# EAGLE design DrinkDispenser (EAGLE 7.5.0)
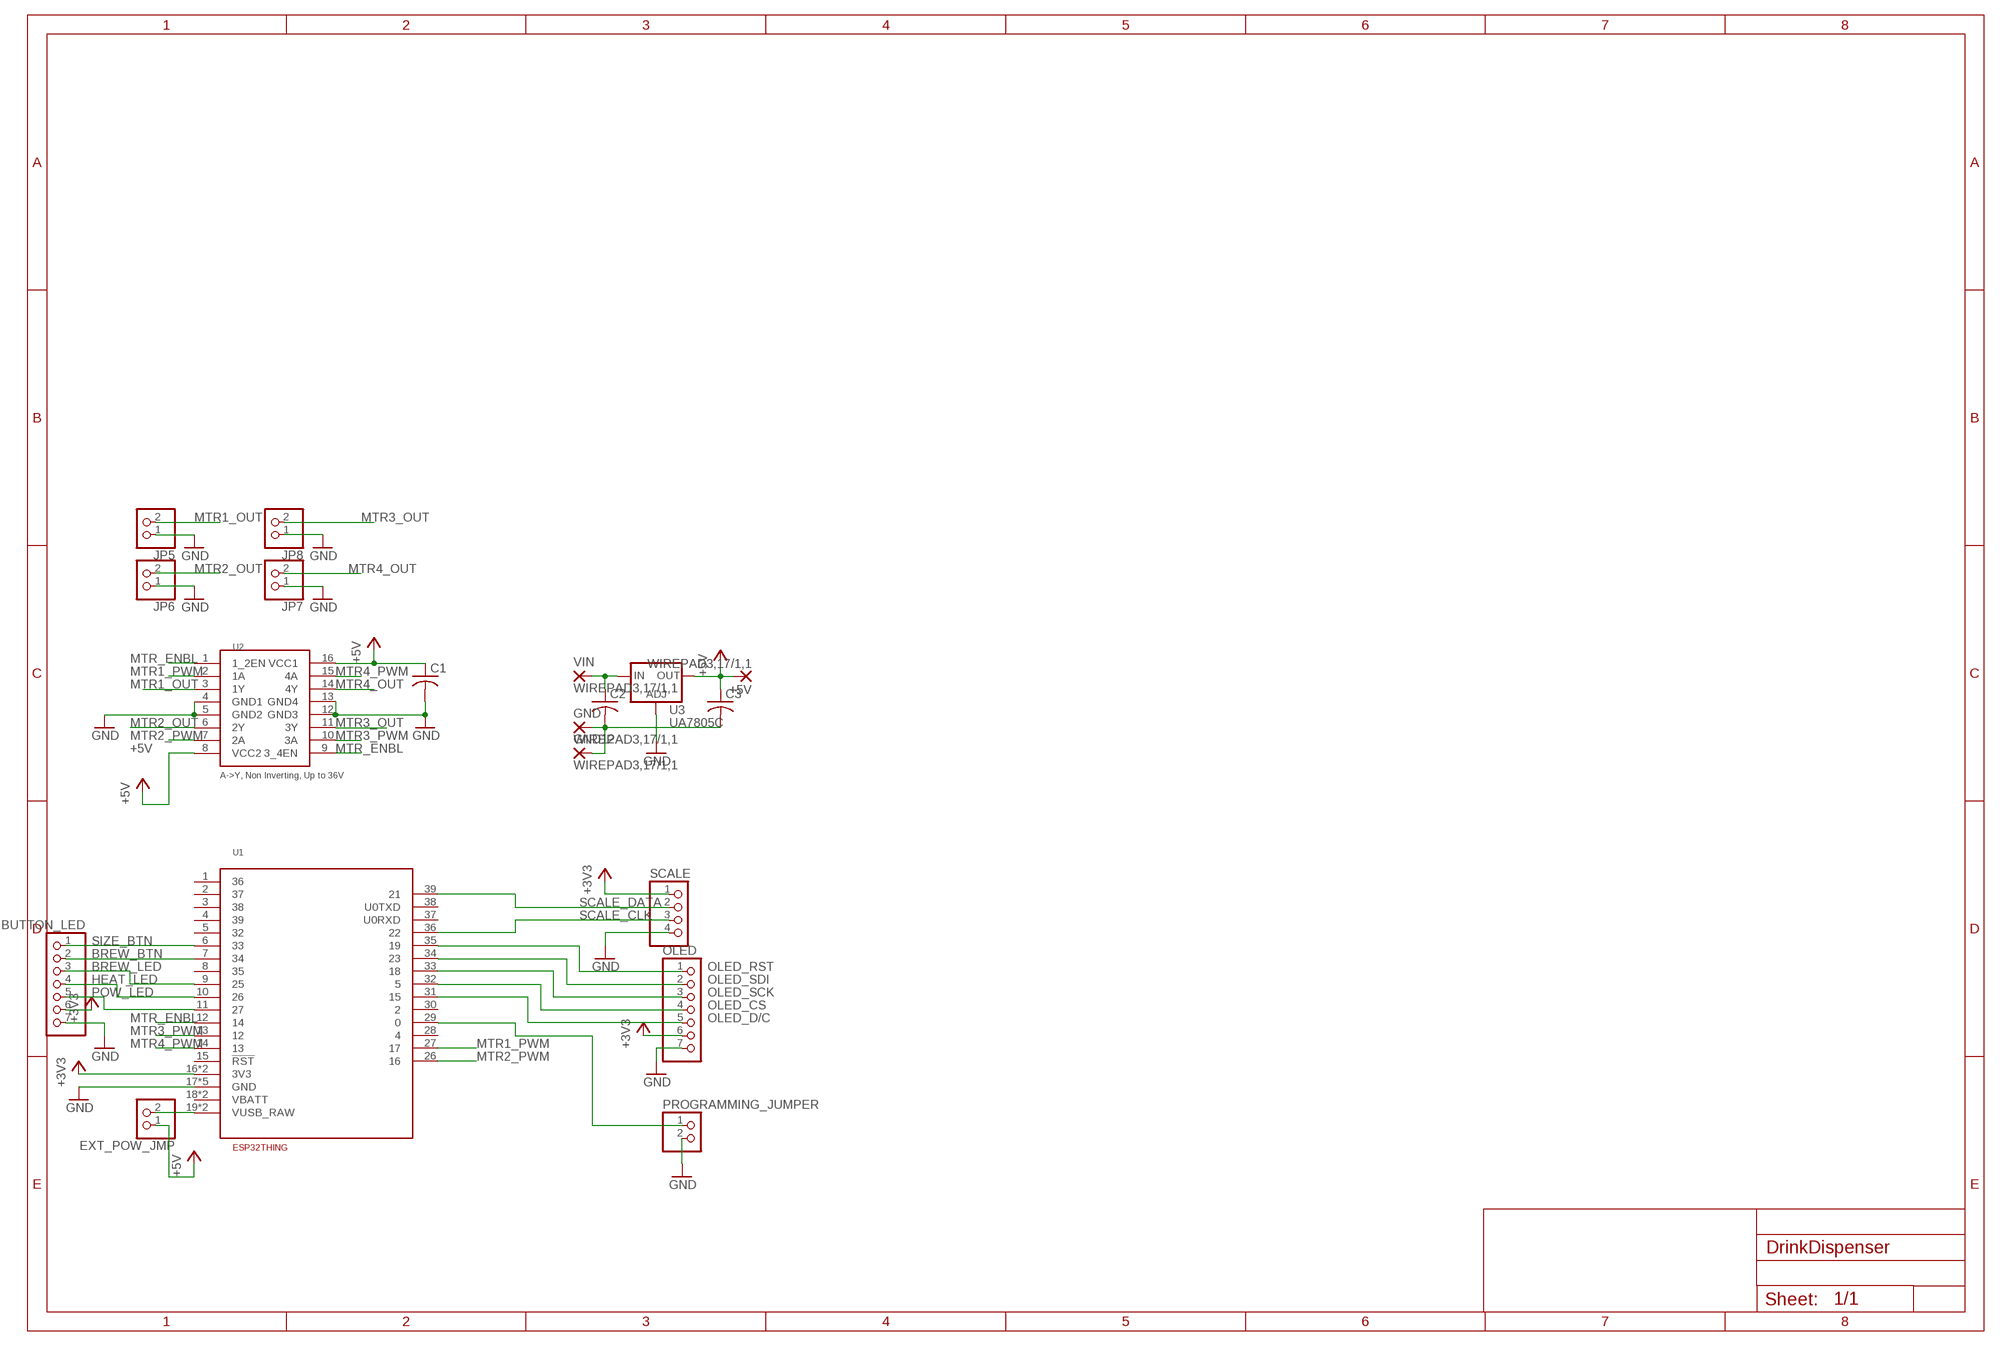
[diagram p0: schematic, sheet 1]

## Parts
+5V  WIREPAD3,17/1,1  [3,17/1,1]
BUTTON_LED  PINHD-1X7  [1X07]
C1  C-USC0805  [C0805]
C2  C-USC0805  [C0805]
C3  C-USC0805  [C0805]
EXT_POW_JMP  PINHD-1X2  [1X02]
GND  WIREPAD3,17/1,1  [3,17/1,1]
GND12  WIREPAD3,17/1,1  [3,17/1,1]
JP5  PINHD-1X2  [1X02]
JP6  PINHD-1X2  [1X02]
JP7  PINHD-1X2  [1X02]
JP8  PINHD-1X2  [1X02]
OLED  PINHD-1X7  [1X07]
PROGRAMMING_JUMPER  PINHD-1X2  [1X02]
SCALE  PINHD-1X4  [1X04]
U1  ESP32THING  [ESP32THING]
U2  L293DDIP16  [DIP16_7.62MM]
U3  UA7805C  [TO-263]
VIN  WIREPAD3,17/1,1  [3,17/1,1]

## Nets
+3V3: BUTTON_LED.6 OLED.6 SCALE.1 U1.16(3V3) U1.25(3V3)
+5V: +5V.1(P) C1.1 C3.1 EXT_POW_JMP.1 U2.8(VCC2) U2.16(VCC1) U3.3(OUT)
BREW_BTN: BUTTON_LED.2 U1.7
BREW_LED: BUTTON_LED.3 U1.9
GND: BUTTON_LED.7 C1.2 C2.2 C3.2 GND12.1(P) GND.1(P) JP5.1 JP6.1 JP7.1 JP8.1 OLED.7 PROGRAMMING_JUMPER.2 SCALE.4 U1.17(GND) U1.20(GND) U1.21(GND) U1.24(GND) U1.40(GND) U2.4(GND1) U2.5(GND2) U2.12(GND3) U2.13(GND4) U3.2(ADJ) U3.4(ADJ)
HEAT_LED: BUTTON_LED.4 U1.10
MTR1_OUT: JP5.2 U2.3(1Y)
MTR1_PWM: U1.27 U2.2(1A)
MTR2_OUT: JP6.2 U2.6(2Y)
MTR2_PWM: U1.26 U2.7(2A)
MTR3_OUT: JP8.2 U2.11(3Y)
MTR3_PWM: U1.13 U2.10(3A)
MTR4_OUT: JP7.2 U2.14(4Y)
MTR4_PWM: U1.14 U2.15(4A)
MTR_ENBL: U1.12 U2.1(1_2EN) U2.9(3_4EN)
N$1: C2.1 U3.1(IN) VIN.1(P)
N$2: EXT_POW_JMP.2 U1.19(VUSB_RAW) U1.23(VUSB_RAW)
N$3: PROGRAMMING_JUMPER.1 U1.29
OLED_CS: OLED.4 U1.32
OLED_D/C: OLED.5 U1.31
OLED_RST: OLED.1 U1.35
OLED_SCK: OLED.3 U1.33
OLED_SDI: OLED.2 U1.34
POW_LED: BUTTON_LED.5 U1.11
SCALE_CLK: SCALE.3 U1.36
SCALE_DATA: SCALE.2 U1.39
SIZE_BTN: BUTTON_LED.1 U1.6
Unconnected: U1.1 U1.2 U1.3 U1.4 U1.5 U1.8 U1.15(!RST) U1.18(VBATT) U1.22(VBATT) U1.28 U1.30 U1.37(U0RXD) U1.38(U0TXD)

## Library data of the parts
+5V GND GND12 VIN = wirepad:WIREPAD: Wire PAD connect wire on PCB
BUTTON_LED OLED = pinhead:PINHD-1X7: PIN HEADER
C1-C3 = DR:C-US: CAPACITOR, American symbol
EXT_POW_JMP JP5-JP8 PROGRAMMING_JUMPER = pinhead:PINHD-1X2: PIN HEADER
SCALE = pinhead:PINHD-1X4: PIN HEADER
U1 = DR:ESP32THING
U2 = DR:L293D: Motor Driver, Quadruple Half-H, 4.5-36V
U3 = DR:UA7805C

## Board
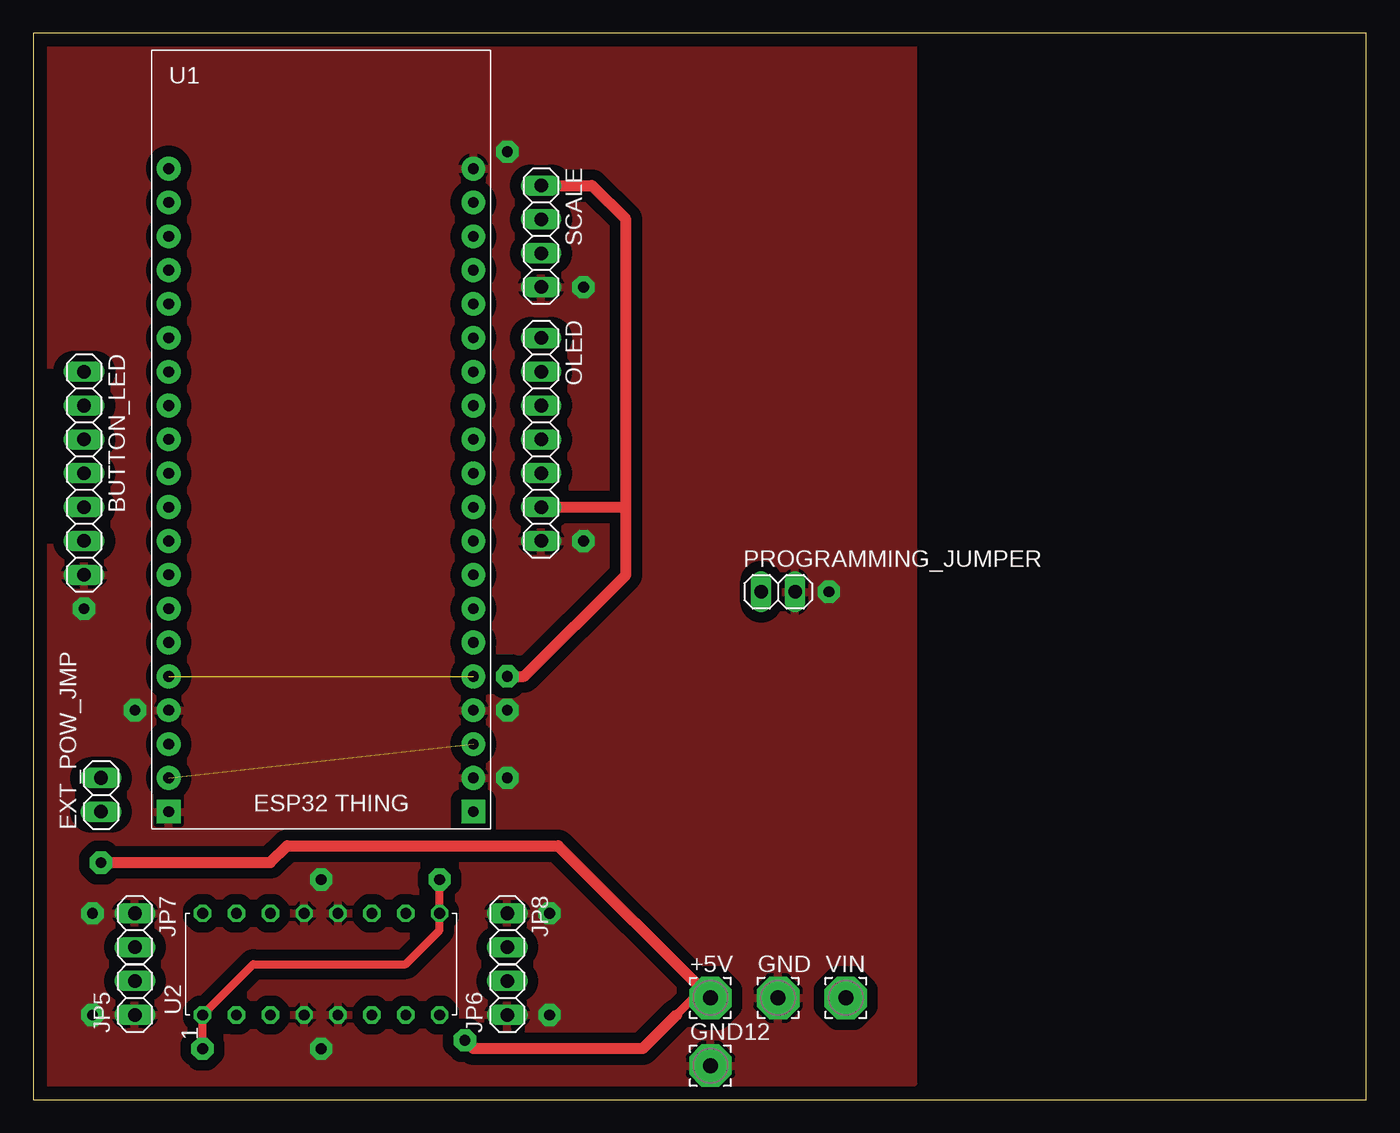
[diagram p1: board, top side]
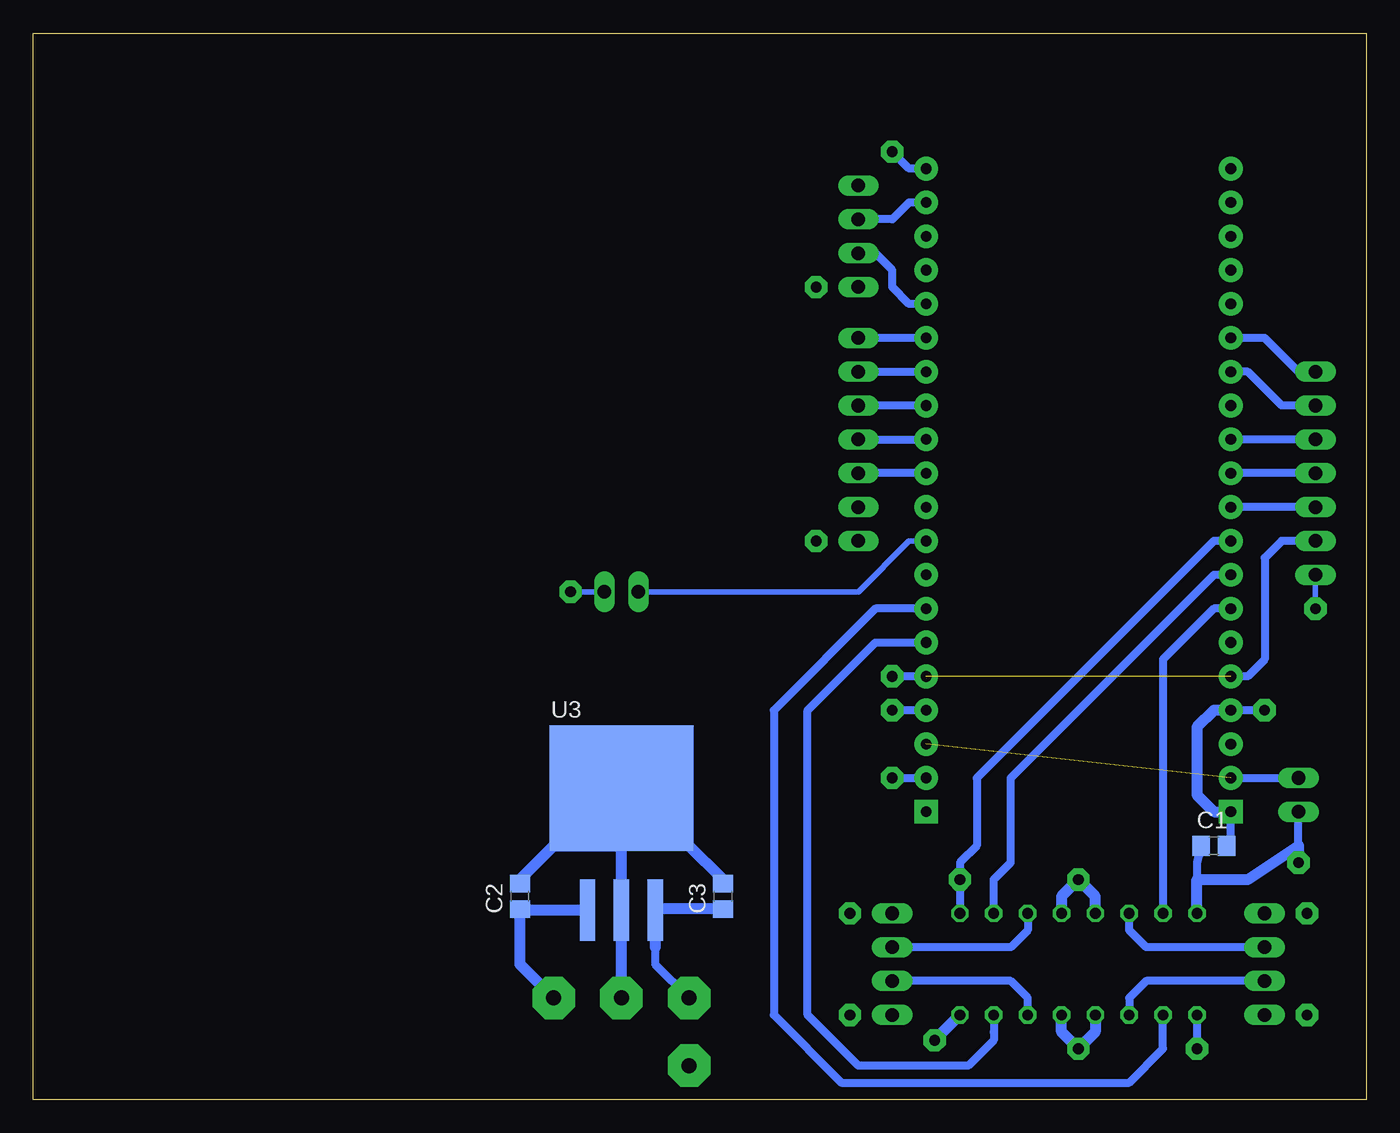
[diagram p2: board, bottom side, seen from below]

Size 100 x 80 mm. Coordinates in mm from the lower left corner, seen from the top.
Outline: 0,0 100,0 100,80 0,80 0,0
Copper layers (1*16): Top 0.035mm / dielectric 1.5mm / Bottom 0.035mm
Design rules "default": minimum track width 10mil, minimum drill 24mil, track to track 8mil, track to pad 8mil, pad to pad 8mil, via to via 8mil, smd to smd 8mil, copper to edge 40mil, drill to drill 8mil, minimum pad ring 10mil, minimum via ring 8mil, stop-mask expansion 4mil, vias tented up to drill 0mil, thermal gap 10mil

### Footprints (pad centres in the part's own frame; a part is rotated, then mirrored left to right if it is on the bottom)
3,17/1,1 = drill 1.118 pad 3.175 octagon: 1 0,0
1X07 = drill 1.016 long: 1 -7.62,0; 2 -5.08,0; 3 -2.54,0; 4 0,0; 5 2.54,0; 6 5.08,0; 7 7.62,0
C0805 = smd 1.3 x 1.5: 1 -0.95,0; 2 0.95,0
1X02 = drill 1.016 long: 1 -1.27,0; 2 1.27,0
1X04 = drill 1.016 long: 1 -3.81,0; 2 -1.27,0; 3 1.27,0; 4 3.81,0
ESP32THING = drill 0.8 pad 1.778: 1 0,48.26; 2 0,45.72; 3 0,43.18; 4 0,40.64; 5 0,38.1; 6 0,35.56; 7 0,33.02; 8 0,30.48; 9 0,27.94; 10 0,25.4; 11 0,22.86; 12 0,20.32; 13 0,17.78; 14 0,15.24; 15 0,12.7; 16 0,10.16; 17 0,7.62; 18 0,5.08; 19 0,2.54; 21 22.86,2.54; 23 22.86,5.08; 24 22.86,7.62; 25 22.86,10.16; 26 22.86,12.7; 27 22.86,15.24; 28 22.86,17.78; 29 22.86,20.32; 30 22.86,22.86; 31 22.86,25.4; 32 22.86,27.94; 33 22.86,30.48; 34 22.86,33.02; 35 22.86,35.56; 36 22.86,38.1; 37 22.86,40.64; 38 22.86,43.18; 39 22.86,45.72; 40 22.86,48.26 | drill 0.8 pad 1.778 square: 20 0,0; 22 22.86,0
DIP16_7.62MM = drill 0.8 octagon: 1 0,0; 2 0,-2.54; 3 0,-5.08; 4 0,-7.62; 5 0,-10.16; 6 0,-12.7; 7 0,-15.24; 8 0,-17.78; 9 7.62,-17.78; 10 7.62,-15.24; 11 7.62,-12.7; 12 7.62,-10.16; 13 7.62,-7.62; 14 7.62,-5.08; 15 7.62,-2.54; 16 7.62,0
TO-263 = smd 1.15 x 4.6: 1 -2.54,-2.3; 2 0,-2.3; 3 2.54,-2.3 | smd 10.8 x 9.4: 4 0,6.85

### Placement (x,y rotation side)
+5V  50.8,7.62 0 top
BUTTON_LED  3.81,46.99 270 top
C1  11.43,19.05 0 bottom
C2  63.5,15.24 90 bottom
C3  48.26,15.24 90 bottom
EXT_POW_JMP  5.08,22.86 90 top
GND  55.88,7.62 0 top
GND12  50.8,2.54 0 top
JP5  7.62,7.62 90 top
JP6  35.56,7.62 90 top
JP7  7.62,12.7 270 top
JP8  35.56,12.7 270 top
OLED  38.1,49.53 270 top
PROGRAMMING_JUMPER  55.88,38.1 0 top
SCALE  38.1,64.77 270 top
U1  10.16,21.59 0 top
U2  12.7,6.35 90 top
U3  55.88,16.51 0 bottom
VIN  60.96,7.62 0 top

### Tracks (layer width: path | path; a pad name or v marks a point on that pad's centre or on a via)
+3V3  (via drill 0.8 pad 1.68)  (1 unrouted)
  Top 0.813: 44.45,44.45 44.45,39.37 36.83,31.75 v35.56,31.75 | 44.45,44.45 44.45,66.04 41.91,68.58 SCALE.1 | OLED.6 44.45,44.45
  Bottom 0.61: BUTTON_LED.6 6.35,41.91 7.62,40.64 7.62,33.02 8.89,31.75 U1.16 | U1.25 v35.56,31.75
+5V  (via drill 0.8 pad 1.68)
  Top 0.61: 48.26,6.35 49.53,7.62 +5V.1
  Top 0.813: 48.26,6.35 45.72,3.81 33.02,3.81 v32.38,4.45 | v5.08,17.78 17.78,17.78 19.05,19.05 39.37,19.05 +5V.1
  Bottom 0.61: C1.1 12.7,17.78 12.7,16.51 | 5.08,19.05 EXT_POW_JMP.1 | 53.34,11.43 53.34,10.16 +5V.1
  Bottom 0.813: C3.1 53.26,14.29 U3.3 53.34,11.43 | v32.38,4.45 U2.8 | U2.16 12.7,16.51 8.89,16.51 5.08,19.05 v5.08,17.78
BREW_BTN
  Bottom 0.61: BUTTON_LED.2 6.35,52.07 8.89,54.61 U1.7
BREW_LED
  Bottom 0.61: BUTTON_LED.3 U1.9
GND  (via drill 0.8 pad 1.68)
  Bottom 0.406: PROGRAMMING_JUMPER.2 v59.69,38.1 | v3.81,36.83 BUTTON_LED.7
  Bottom 0.61: C1.2 10.16,19.05 U1.20 | U1.40 34.29,69.85 v35.56,71.12 | U1.24 v35.56,29.21 | v35.56,24.13 U1.21 | v7.62,29.21 U1.17
  Bottom 0.813: GND.1 U3.2 55.88,19.05 | 55.88,19.05 U3.4 | C3.2 48.26,16.51 50.8,19.05 55.88,19.05 | C2.2 63.5,16.51 60.96,19.05 55.88,19.05 | U1.17 11.43,29.21 12.7,27.94 12.7,22.86 11.43,21.59 U1.20 | U2.4 20.32,5.08 v21.59,3.81 22.86,5.08 U2.5 | U2.13 20.32,15.24 v21.59,16.51 22.86,15.24 U2.12
  other vias: 41.27,60.96 41.27,41.91 4.45,13.97 4.45,6.35 38.73,6.35 38.73,13.97
  pour Top (isolate 0.813): 0,0 66.04,1.27 66.04,80.01 0,80.01
HEAT_LED
  Bottom 0.61: BUTTON_LED.4 U1.10
MTR1_OUT
  Bottom 0.61: JP5.2 16.51,8.89 17.78,7.62 U2.3
MTR1_PWM
  Bottom 0.61: U1.27 36.83,36.83 44.45,29.21 44.45,6.35 39.37,1.27 17.78,1.27 15.24,3.81 U2.2
MTR2_OUT
  Bottom 0.61: U2.6 25.4,7.62 26.67,8.89 JP6.2
MTR2_PWM
  Bottom 0.61: 27.94,5.08 U2.7 27.94,4.45 29.84,2.54 38.1,2.54 41.91,6.35 41.91,29.21 36.83,34.29 U1.26
MTR3_OUT
  Bottom 0.61: U2.11 25.4,12.7 26.67,11.43 JP8.2
MTR3_PWM
  Bottom 0.61: U2.10 27.94,16.51 26.67,17.78 26.67,24.13 11.43,39.37 U1.13
MTR4_OUT
  Bottom 0.61: U2.14 17.78,12.7 16.51,11.43 JP7.2
MTR4_PWM
  Bottom 0.61: U1.14 11.43,36.83 15.24,33.02 U2.15
MTR_ENBL  (via drill 0.8 pad 1.68)
  Top 0.61: v12.7,3.81 U2.1 16.51,10.16 27.94,10.16 30.48,12.7 v30.48,16.51
  Bottom 0.61: U1.12 11.43,41.91 29.21,24.13 29.21,19.05 30.48,17.78 v30.48,16.51 U2.9 | U2.1 v12.7,3.81
N$1
  Bottom 0.813: VIN.1 63.5,10.16 C2.1 63.42,14.21 U3.1
N$2  (1 unrouted)
  Bottom 0.61: U1.19 EXT_POW_JMP.2
N$3
  Bottom 0.406: U1.29 34.29,41.91 38.1,38.1 PROGRAMMING_JUMPER.1
OLED_CS
  Bottom 0.61: OLED.4 U1.32
OLED_D/C
  Bottom 0.61: U1.31 OLED.5
OLED_RST
  Bottom 0.61: U1.35 OLED.1
OLED_SCK
  Bottom 0.61: U1.33 OLED.3
OLED_SDI
  Bottom 0.61: OLED.2 U1.34
POW_LED
  Bottom 0.61: BUTTON_LED.5 U1.11
SCALE_CLK
  Bottom 0.61: U1.36 34.29,59.69 35.56,60.96 35.56,62.23 36.83,63.5 SCALE.3
SCALE_DATA
  Bottom 0.61: U1.39 34.29,67.31 35.56,66.04 SCALE.2
SIZE_BTN
  Bottom 0.61: BUTTON_LED.1 5.08,54.61 7.62,57.15 U1.6